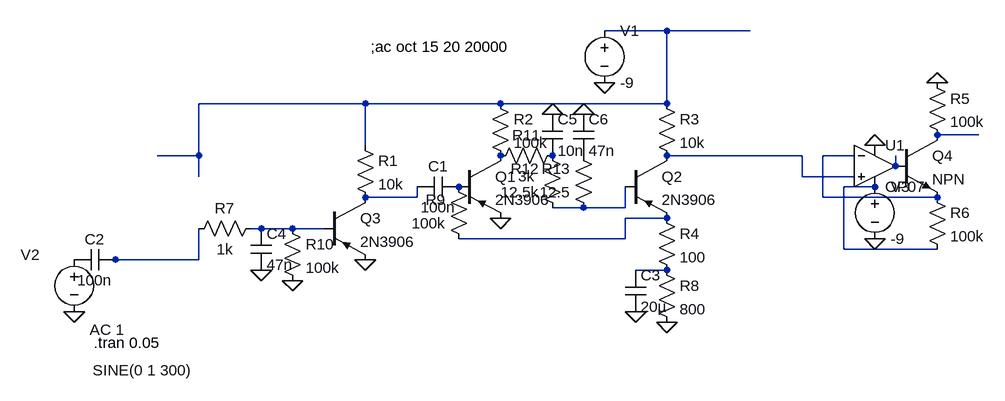
[diagram p0: schematic toneDexer.asc]
toneDexer.asc, the LTspice schematic file:
Version 4
SHEET 1 992 680
WIRE 496 -112 400 -112
WIRE 624 -112 496 -112
WIRE 32 0 -224 0
WIRE 240 0 32 0
WIRE 496 0 496 -112
WIRE 496 0 240 0
WIRE 976 48 912 48
WIRE 32 64 32 0
WIRE -224 80 -224 0
WIRE -224 80 -288 80
WIRE 704 80 496 80
WIRE 784 80 736 80
WIRE 848 96 848 80
WIRE -224 112 -224 80
WIRE 704 112 704 80
WIRE 784 112 704 112
WIRE 816 128 768 128
WIRE 112 144 112 128
WIRE 112 144 32 144
WIRE 736 144 736 80
WIRE 912 144 736 144
WIRE 368 160 320 160
WIRE 432 160 432 128
WIRE 432 160 368 160
WIRE 496 176 432 176
WIRE -128 192 -144 192
WIRE -80 192 -128 192
WIRE -32 192 -80 192
WIRE 432 208 432 176
WIRE 432 208 176 208
WIRE 768 224 768 128
WIRE 912 224 768 224
WIRE -352 240 -368 240
WIRE -224 240 -224 192
WIRE -224 240 -352 240
WIRE 496 256 448 256
FLAG 400 -32 0
FLAG 496 336 0
FLAG 240 176 0
FLAG -416 320 0
FLAG 32 240 0
FLAG 448 320 0
FLAG 816 64 0
FLAG 816 208 0
FLAG 912 -32 0
FLAG -80 272 0
FLAG -128 256 0
FLAG 320 16 0
FLAG 368 16 0
SYMBOL pnp 176 80 R0
SYMATTR InstName Q1
SYMATTR Value 2N3906
SYMBOL pnp -32 144 R0
SYMATTR InstName Q3
SYMATTR Value 2N3906
SYMBOL res 16 48 R0
SYMATTR InstName R1
SYMATTR Value 10k
SYMBOL res 224 -16 R0
SYMATTR InstName R2
SYMATTR Value 100k
SYMBOL res 480 -16 R0
SYMATTR InstName R3
SYMATTR Value 10k
SYMBOL res 480 160 R0
SYMATTR InstName R4
SYMATTR Value 100
SYMBOL voltage 400 -128 R0
WINDOW 123 0 0 Left 0
WINDOW 39 0 0 Left 0
SYMATTR InstName V1
SYMATTR Value -9
SYMBOL res -128 176 R90
WINDOW 0 0 56 VBottom 2
WINDOW 3 32 56 VTop 2
SYMATTR InstName R7
SYMATTR Value 1k
SYMBOL res 480 240 R0
SYMATTR InstName R8
SYMATTR Value 800
SYMBOL res 192 224 R180
WINDOW 0 36 76 Left 2
WINDOW 3 36 40 Left 2
SYMATTR InstName R9
SYMATTR Value 100k
SYMBOL cap 176 112 R90
WINDOW 0 0 32 VBottom 2
WINDOW 3 32 32 VTop 2
SYMATTR InstName C1
SYMATTR Value 100n
SYMBOL cap -352 224 R90
WINDOW 0 0 32 VBottom 2
WINDOW 3 32 32 VTop 2
SYMATTR InstName C2
SYMATTR Value 100n
SYMBOL voltage -416 224 R0
WINDOW 0 -82 8 Left 2
WINDOW 3 29 186 Left 2
WINDOW 123 24 124 Left 2
WINDOW 39 0 0 Left 0
SYMATTR InstName V2
SYMATTR Value SINE(0 1 300)
SYMATTR Value2 AC 1
SYMBOL cap 432 256 R0
SYMATTR InstName C3
SYMATTR Value 20µ
SYMBOL pnp 432 80 R0
SYMATTR InstName Q2
SYMATTR Value 2N3906
SYMBOL Opamps\\OP07 816 32 R0
SYMATTR InstName U1
SYMBOL voltage 816 112 R0
WINDOW 123 0 0 Left 0
WINDOW 39 0 0 Left 0
SYMATTR InstName V3
SYMATTR Value -9
SYMBOL npn 848 48 R0
SYMATTR InstName Q4
SYMBOL res 896 -48 R0
SYMATTR InstName R5
SYMATTR Value 100k
SYMBOL res 896 128 R0
SYMATTR InstName R6
SYMATTR Value 100k
SYMBOL res -96 176 R0
SYMATTR InstName R10
SYMATTR Value 100k
SYMBOL cap -144 192 R0
SYMATTR InstName C4
SYMATTR Value 47n
SYMBOL res 336 64 R90
WINDOW 0 0 56 VBottom 2
WINDOW 3 32 56 VTop 2
SYMATTR InstName R11
SYMATTR Value 3k
SYMBOL cap 304 16 R0
SYMATTR InstName C5
SYMATTR Value 10n
SYMBOL res 336 176 R180
WINDOW 0 36 76 Left 2
WINDOW 3 36 40 Left 2
SYMATTR InstName R12
SYMATTR Value 12.5k
SYMBOL res 384 176 R180
WINDOW 0 36 76 Left 2
WINDOW 3 36 40 Left 2
SYMATTR InstName R13
SYMATTR Value 12.5
SYMBOL cap 352 16 R0
SYMATTR InstName C6
SYMATTR Value 47n
TEXT -386 368 Left 2 !.tran 0.05
TEXT 40 -88 Left 2 !;ac oct 15 20 20000

The netlist it stands for:
* toneDexer.asc
Q1 P001 P002 0 0 2N3906
Q3 N007 N010 0 0 2N3906
R1 N001 N007 10k
R2 N001 P001 100k
R3 N001 N003 10k
R4 N009 N012 100
V1 N001 0 -9
R7 N010 N011 1k
R8 N012 0 800
R9 N009 P002 100k
C1 P002 N007 100n
C2 N011 P003 100n
V2 P003 0 SINE(0 1 300) AC 1
C3 N012 0 20µ
Q2 N003 N008 N009 0 2N3906
XU1 N003 N004 0 N006 N005 LT1001  ; OP07, pins In+ In- V+ V- OUT
V3 N006 0 -9
Q4 N002 N005 N004 0 NPN
R5 0 N002 100k
R6 N004 N006 100k
R10 N010 0 100k
C4 N010 0 47n
R11 P004 P001 3k
C5 0 P004 10n
R12 N008 P004 12.5k
R13 N008 P005 12.5
C6 0 P005 47n
.model NPN NPN
.model PNP PNP
.lib standard.bjt
.tran 0.05
;ac oct 15 20 20000
.lib LTC.lib
.backanno
.end